# EAGLE design FiveLEDsPuzzle (EAGLE 7.6.0)
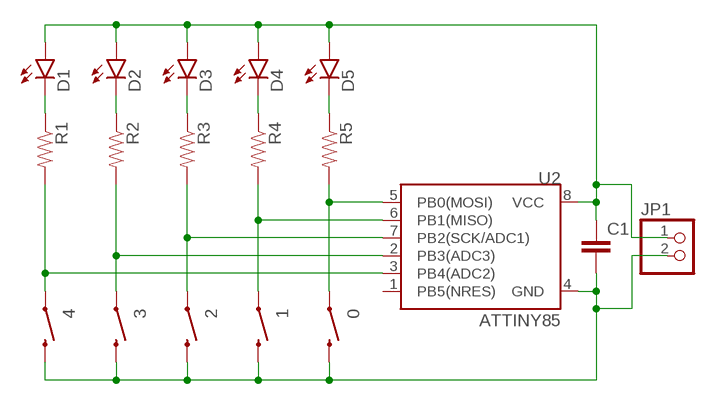
[diagram p0: schematic, sheet 1]

## Parts
0  SWITCH-MOMENTARY-2PTH  [TACTILE-PTH]
1  SWITCH-MOMENTARY-2PTH  [TACTILE-PTH]
2  SWITCH-MOMENTARY-2PTH  [TACTILE-PTH]
3  SWITCH-MOMENTARY-2PTH  [TACTILE-PTH]
4  SWITCH-MOMENTARY-2PTH  [TACTILE-PTH]
C1  0.1UF-50V-20%(PTH)KIT-EZ  [CAP-PTH-SMALL-KIT]
D1  LED5MM  [LED5MM]
D2  LED5MM  [LED5MM]
D3  LED5MM  [LED5MM]
D4  LED5MM  [LED5MM]
D5  LED5MM  [LED5MM]
JP1  HEADER-1X2ROUND  [1X02_ROUND]
R1  RESISTORAXIAL-0.3  [AXIAL-0.3]
R2  RESISTORAXIAL-0.3  [AXIAL-0.3]
R3  RESISTORAXIAL-0.3  [AXIAL-0.3]
R4  RESISTORAXIAL-0.3  [AXIAL-0.3]
R5  RESISTORAXIAL-0.3  [AXIAL-0.3]
U2  ATTINY85  ATTINY45TINY85-20-DIP  [DIP08]

## Nets
N$1: 3.1 R2.P$2 U2.2(PB3(ADC3))
N$2: D2.K(C) R2.P$1
N$3: 2.1 R3.P$2 U2.7(PB2(SCK/ADC1))
N$4: D3.K(C) R3.P$1
N$5: 4.1 R1.P$2 U2.3(PB4(ADC2))
N$6: 1.1 R4.P$2 U2.6(PB1(MISO))
N$7: D4.K(C) R4.P$1
N$8: C1.1 D1.A D2.A D3.A D4.A D5.A JP1.1 U2.8(VCC)
N$9: D5.K(C) R5.P$1
N$10: 0.1 R5.P$2 U2.5(PB0(MOSI))
N$11: 0.3 1.3 2.3 3.3 4.3 C1.2 JP1.2 U2.4(GND)
N$13: D1.K(C) R1.P$1
Unconnected: U2.1(PB5(NRES))

## Library data of the parts
0 1-4 = SparkFun-Electromechanical:SWITCH-MOMENTARY-2: Various NO switches- pushbuttons, reed, etc; PROD_ID: SWCH-08441
C1 = SparkFun-Capacitors:0.1UF-50V-20%(PTH): CAP-08370; PROD_ID: CAP-08370
D1-D5 = SparkFun-LED:LED: LEDs Standard schematic elements and footprints for 5mm, 3mm, 1206, and 0603 sized LEDs. 5mm - Spark Fun Electronics SKU : COM-00529 (and others)
JP1 = microbuilder:HEADER-1X2: PIN HEADER
R1-R5 = SparkFun-Passives:RESISTOR: Resistor Basic schematic elements and footprints for 0603, 1206, and PTH resistors.
U2 = SparkFun-DigitalIC:ATTINY45: Atmel 8-pin 2/4/8kB flash uC; PROD_ID: IC-09445; VALUE: TINY85-20-DIP

## Board
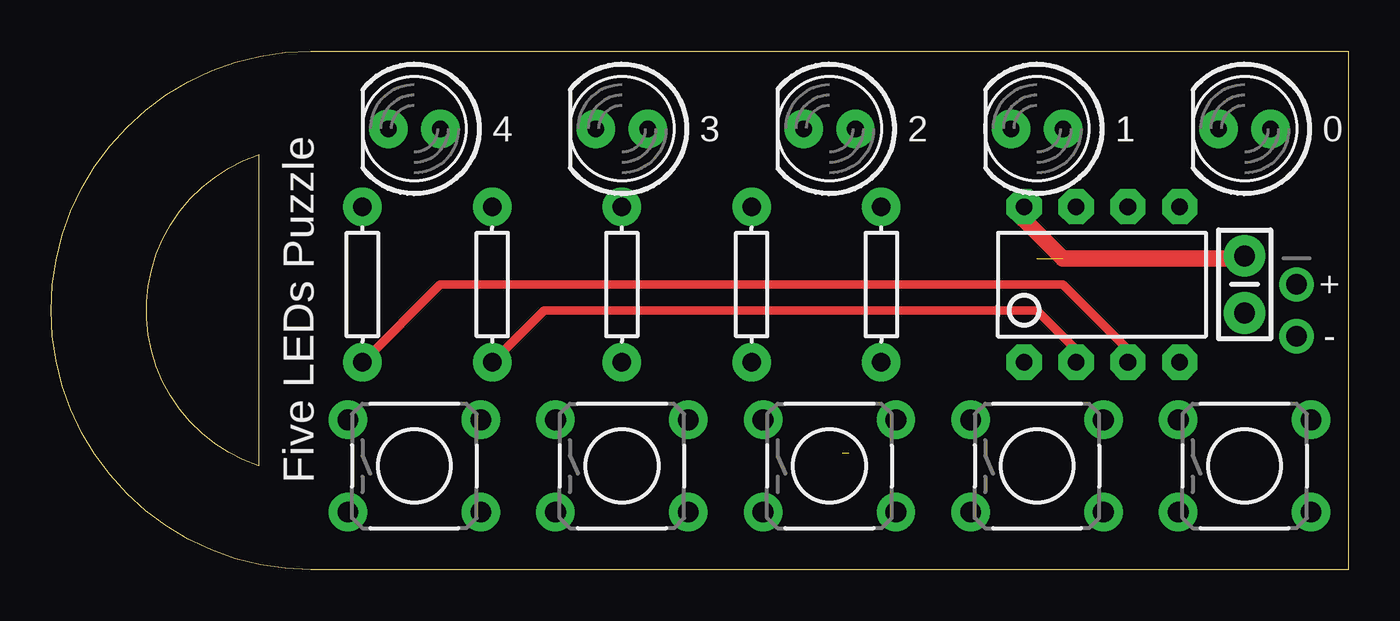
[diagram p1: board, top side]
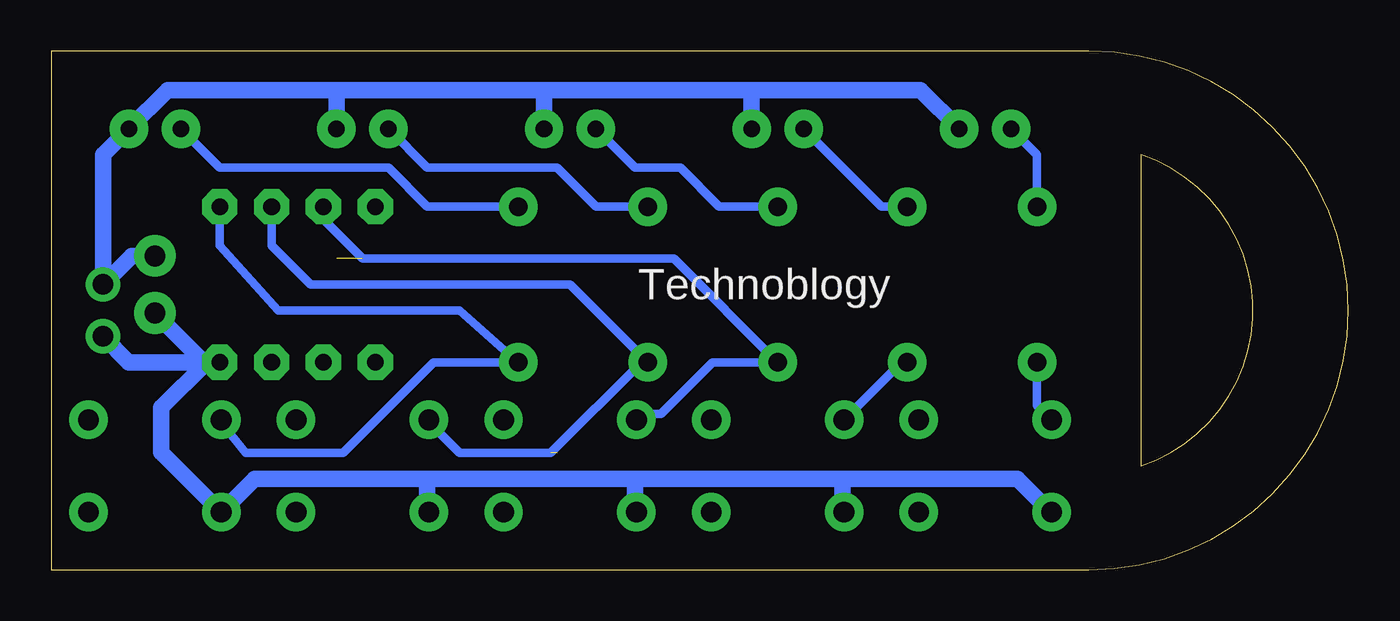
[diagram p2: board, bottom side, seen from below]

Size 63.5 x 25.4 mm. Coordinates in mm from the lower left corner, seen from the top.
Outline: 12.7,25.4 63.5,25.4 63.5,0 12.7,0 arc-180 12.7,25.4
Outline: 10.16,5.08 arc-143 10.16,20.32 10.16,5.08
Copper layers (1*16): Top 0.035mm / dielectric 1.5mm / Bottom 0.035mm
Design rules "default": minimum track width 10mil, minimum drill 24mil, track to track 8mil, track to pad 8mil, pad to pad 8mil, via to via 8mil, smd to smd 8mil, copper to edge 40mil, drill to drill 8mil, minimum pad ring 10mil, minimum via ring 8mil, stop-mask expansion 4mil, vias tented up to drill 0mil, thermal gap 10mil

### Footprints (pad centres in the part's own frame; a part is rotated, then mirrored left to right if it is on the bottom)
TACTILE-PTH = drill 1.016 pad 1.88: 1 -3.251,2.261; 2 3.251,2.261; 3 -3.251,-2.261; 4 3.251,-2.261
CAP-PTH-SMALL-KIT = drill 1.016 pad 2.032: 1 -1.397,0; 2 1.397,0
LED5MM = drill 0.813 pad 1.88: A -1.27,0; K 1.27,0
1X02_ROUND = drill 1 pad 1.676: 1 -1.27,0; 2 1.27,0
AXIAL-0.3 = drill 0.9 pad 1.88: P$1 -3.81,0; P$2 3.81,0
DIP08 = drill 0.813 pad 1.727 octagon: 1 -3.81,-3.81; 2 -1.27,-3.81; 3 1.27,-3.81; 4 3.81,-3.81; 5 3.81,3.81; 6 1.27,3.81; 7 -1.27,3.81; 8 -3.81,3.81

### Placement (x,y rotation side)
0  58.42,5.08 0 top
1  48.26,5.08 0 top
2  38.1,5.08 0 top
3  27.94,5.08 0 top
4  17.78,5.08 0 top
C1  58.42,13.97 270 top
D1  17.78,21.59 180 top
D2  27.94,21.59 180 top
D3  38.1,21.59 180 top
D4  48.26,21.59 180 top
D5  58.42,21.59 180 top
JP1  60.96,12.7 270 top
R1  15.24,13.97 270 top
R2  21.59,13.97 270 top
R3  27.94,13.97 270 top
R4  34.29,13.97 270 top
R5  40.64,13.97 270 top
U2  51.44,13.97 0 top

### Tracks (layer width: path | path; a pad name or v marks a point on that pad's centre or on a via)
N$1
  Top 0.406: U2.2 50.17,10.79 48.26,12.7 24.13,12.7 R2.P$2
  Bottom 0.406: R2.P$2 21.87,10.16 3.1
N$2
  Bottom 0.406: R2.P$1 22.86,17.78 D2.K
N$3
  Bottom 0.406: 2.1 34.57,7.62 33.66,7.62 31.11,10.16 R3.P$2 33.02,15.24 48.26,15.24 50.17,17.14 U2.7
N$4
  Bottom 0.406: R3.P$1 30.8,17.78 32.7,19.68 34.92,19.68 D3.K
N$5
  Top 0.406: U2.3 52.7,10.79 49.53,13.97 19.05,13.97 R1.P$2
  Bottom 0.406: R1.P$2 15.24,8.05 4.1
N$6  (1 unrouted)
  Bottom 0.406: 1.1 45.01,7.23 43.5,5.71 39.05,5.71 34.61,10.16 R4.P$2 38.1,13.97 50.8,13.97 52.7,15.88 U2.6
N$7
  Bottom 0.406: R4.P$1 36.83,17.78 38.73,19.68 45.08,19.68 D4.K
N$8  (1 unrouted)
  Top 0.406: 58.29,15.24 C1.1
  Top 0.813: 58.29,15.24 49.53,15.24 47.62,17.14 U2.8
  Bottom 0.813: D1.A 20.95,23.5 29.21,23.5 | 29.21,23.5 39.37,23.5 | 39.37,23.5 49.53,23.5 | 49.53,23.5 57.78,23.5 D5.A 60.96,20.32 JP1.1 59.56,15.37 C1.1 | D2.A 29.21,23.5 | D3.A 39.37,23.5 | D4.A 49.53,23.5
N$9
  Bottom 0.406: R5.P$1 45.08,17.78 46.99,19.68 55.25,19.68 D5.K
N$10
  Bottom 0.406: 0.1 55.17,7.23 53.97,5.71 49.21,5.71 44.77,10.16 R5.P$2 43.5,12.7 52.39,12.7 55.25,15.88 U2.5
N$11
  Bottom 0.406: 4.3 14.57,2.82 | 3.3 24.77,2.82 | 2.3 34.92,2.82 | 1.3 45.08,2.82 | U2.4 55.88,10.16
  Bottom 0.813: 14.57,2.82 16.19,4.45 24.77,4.45 | 24.77,4.45 34.92,4.45 | 34.92,4.45 45.08,4.45 | 45.08,4.45 53.54,4.45 0.3 58.1,5.75 58.1,7.94 55.88,10.16 59.69,10.16 JP1.2 | 24.77,2.82 24.77,4.45 | 34.92,2.82 34.92,4.45 | 45.08,2.82 45.08,4.45 | C1.2 56.01,10.16 U2.4
N$13
  Bottom 0.406: D1.K 15.24,20.32 R1.P$1

### Text on the board
tPlace: + | Five LEDs Puzzle | -
bPlace: Technoblogy